# Altium schematic sheet 顶层设计.SchDoc
size A4; Organization: Altium Limited; Address1: L3, 12a Rodborough Rd; Address2: Frenchs Forest; Address3: NSW; Address4: Australia 2086
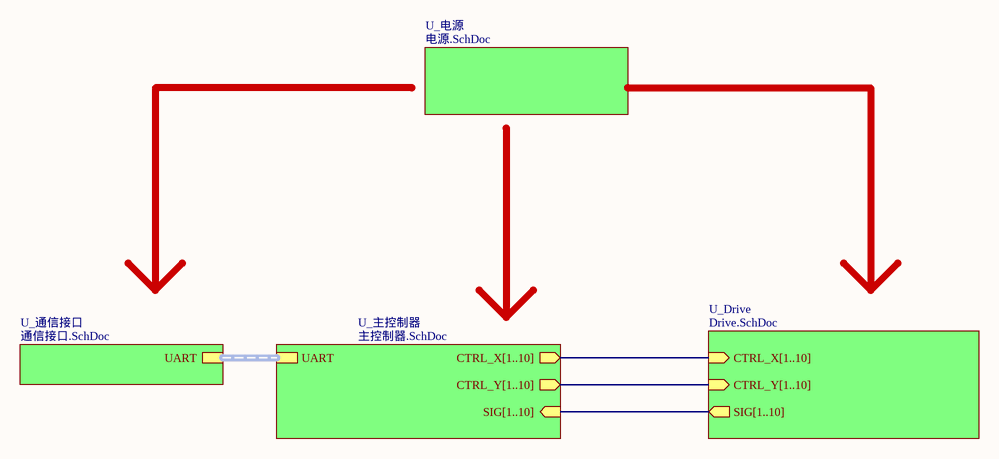
[diagram p0: 顶层设计.SchDoc]

## Sub-sheets
U_Drive = Drive.SchDoc: CTRL_Y[1..10] (in), SIG[1..10] (out), CTRL_X[1..10] (in)
U_主控制器 = 主控制器.SchDoc: CTRL_X[1..10] (out), CTRL_Y[1..10] (out), SIG[1..10] (in), UART (harness USART)
U_电源 = 电源.SchDoc: no entries
U_通信接口 = 通信接口.SchDoc: UART (harness USART)

## Buses and harness runs
bus sheet U_Drive/CTRL_X[1..10] = sheet U_主控制器/CTRL_X[1..10]
bus sheet U_Drive/CTRL_Y[1..10] = sheet U_主控制器/CTRL_Y[1..10]
bus sheet U_Drive/SIG[1..10] = sheet U_主控制器/SIG[1..10]
harness sheet U_主控制器/UART = sheet U_通信接口/UART

## Notes on the sheet
- Title
- Size:
- Date:
- A4
- Number:
- Time:
- Revision:
- Sheet
- of
- File: